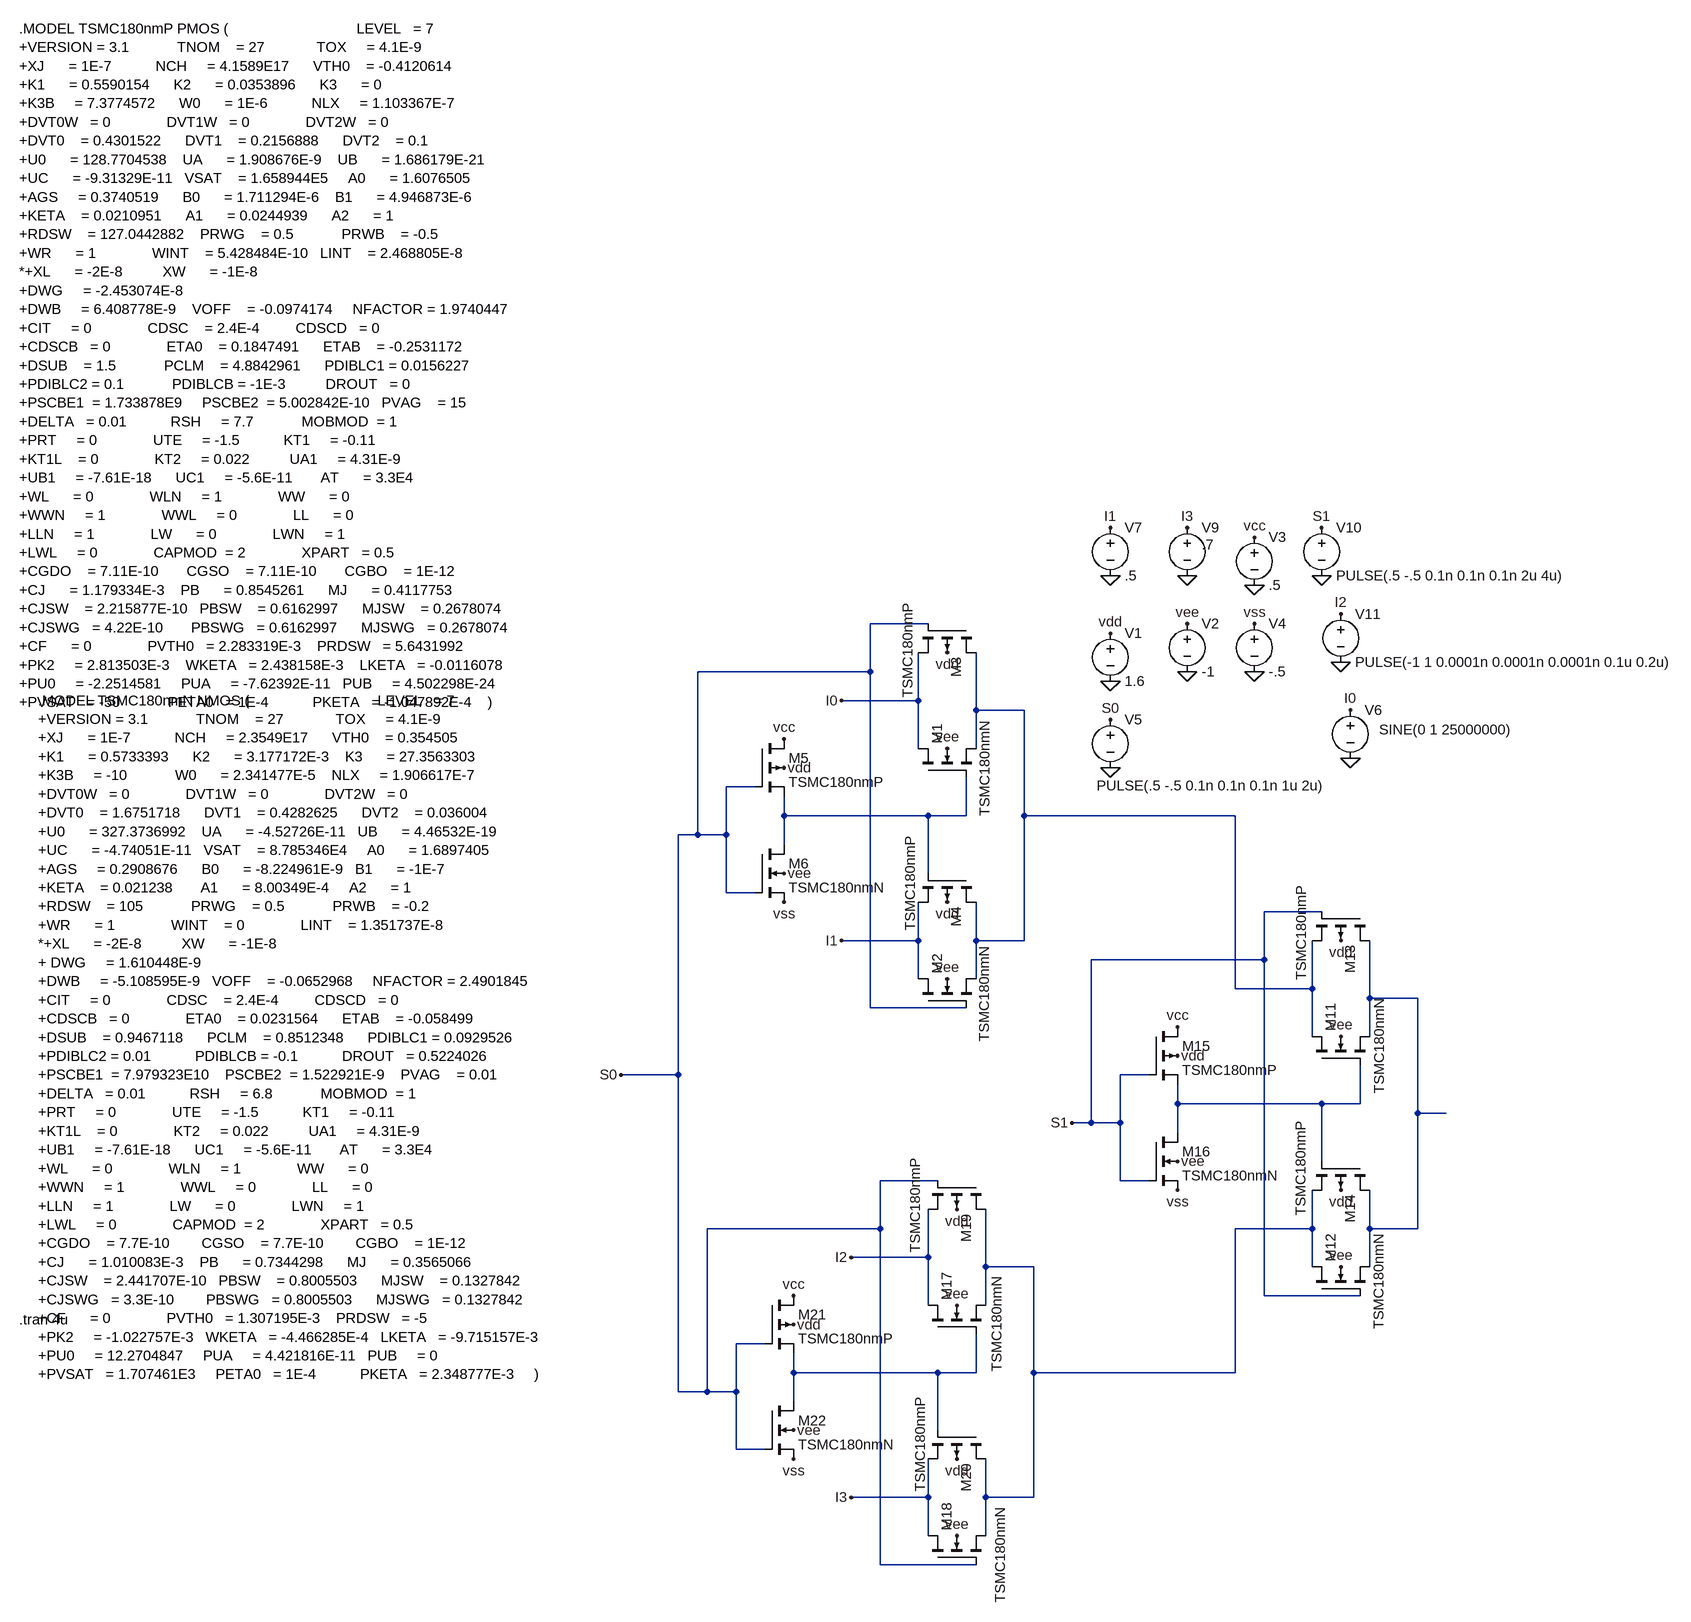
[diagram p0: schematic Data Acquisition System.asc]
Data Acquisition System.asc, the LTspice schematic file:
Version 4
SHEET 1 3424 1956
WIRE 1104 320 1008 320
WIRE 1008 400 1008 320
WIRE 1008 400 720 400
WIRE 1088 448 1088 368
WIRE 1088 448 960 448
WIRE 1184 464 1184 368
WIRE 1264 464 1184 464
WIRE 1088 528 1088 448
WIRE 1184 528 1184 464
WIRE 816 592 768 592
WIRE 864 640 864 608
WIRE 1104 640 864 640
WIRE 1168 640 1168 576
WIRE 1168 640 1104 640
WIRE 1264 640 1264 464
WIRE 1616 640 1264 640
WIRE 720 672 720 400
WIRE 720 672 688 672
WIRE 768 672 768 592
WIRE 768 672 720 672
WIRE 864 688 864 640
WIRE 1104 736 1104 640
WIRE 768 768 768 672
WIRE 816 768 768 768
WIRE 1760 800 1664 800
WIRE 1088 848 1088 784
WIRE 1088 848 960 848
WIRE 1184 848 1184 784
WIRE 1264 848 1264 640
WIRE 1264 848 1184 848
WIRE 1664 880 1664 800
WIRE 1664 880 1376 880
WIRE 1088 912 1088 848
WIRE 1184 912 1184 848
WIRE 1616 928 1616 640
WIRE 1744 928 1744 848
WIRE 1744 928 1616 928
WIRE 1840 944 1840 848
WIRE 1920 944 1840 944
WIRE 1008 960 1008 400
WIRE 1168 960 1008 960
WIRE 1744 1008 1744 928
WIRE 1840 1008 1840 944
WIRE 688 1072 688 672
WIRE 688 1072 592 1072
WIRE 1472 1072 1424 1072
WIRE 1520 1120 1520 1088
WIRE 1760 1120 1520 1120
WIRE 1824 1120 1824 1056
WIRE 1824 1120 1760 1120
WIRE 1920 1136 1920 944
WIRE 1968 1136 1920 1136
WIRE 1376 1152 1376 880
WIRE 1376 1152 1344 1152
WIRE 1424 1152 1424 1072
WIRE 1424 1152 1376 1152
WIRE 1520 1168 1520 1120
WIRE 1760 1216 1760 1120
WIRE 1120 1248 1024 1248
WIRE 1424 1248 1424 1152
WIRE 1472 1248 1424 1248
WIRE 1024 1328 1024 1248
WIRE 1024 1328 736 1328
WIRE 1744 1328 1744 1264
WIRE 1744 1328 1616 1328
WIRE 1840 1328 1840 1264
WIRE 1920 1328 1920 1136
WIRE 1920 1328 1840 1328
WIRE 1104 1376 1104 1296
WIRE 1104 1376 976 1376
WIRE 1200 1392 1200 1296
WIRE 1280 1392 1200 1392
WIRE 1744 1392 1744 1328
WIRE 1840 1392 1840 1328
WIRE 1664 1440 1664 880
WIRE 1824 1440 1664 1440
WIRE 1104 1456 1104 1376
WIRE 1200 1456 1200 1392
WIRE 832 1520 784 1520
WIRE 880 1568 880 1536
WIRE 1120 1568 880 1568
WIRE 1184 1568 1184 1504
WIRE 1184 1568 1120 1568
WIRE 1280 1568 1280 1392
WIRE 1616 1568 1616 1328
WIRE 1616 1568 1280 1568
WIRE 688 1600 688 1072
WIRE 736 1600 736 1328
WIRE 736 1600 688 1600
WIRE 784 1600 784 1520
WIRE 784 1600 736 1600
WIRE 880 1616 880 1568
WIRE 1120 1664 1120 1568
WIRE 784 1696 784 1600
WIRE 832 1696 784 1696
WIRE 1104 1776 1104 1712
WIRE 1104 1776 976 1776
WIRE 1200 1776 1200 1712
WIRE 1280 1776 1280 1568
WIRE 1280 1776 1200 1776
WIRE 1104 1840 1104 1776
WIRE 1200 1840 1200 1776
WIRE 1024 1888 1024 1328
WIRE 1184 1888 1024 1888
FLAG 1408 416 0
FLAG 1536 400 0
FLAG 1648 256 0
FLAG 1648 400 0
FLAG 1408 560 0
FLAG 1808 544 0
FLAG 1408 336 vdd
FLAG 1136 368 vdd
FLAG 1136 784 vdd
FLAG 1536 320 vee
FLAG 1136 528 vee
FLAG 1136 912 vee
FLAG 1648 176 vcc
FLAG 864 512 vcc
FLAG 1648 320 vss
FLAG 864 784 vss
FLAG 960 448 I0
FLAG 1808 464 I0
FLAG 960 848 I1
FLAG 1408 160 I1
FLAG 1408 240 0
FLAG 864 560 vdd
FLAG 864 736 vee
FLAG 1792 848 vdd
FLAG 1792 1264 vdd
FLAG 1792 1008 vee
FLAG 1792 1392 vee
FLAG 1520 992 vcc
FLAG 1520 1264 vss
FLAG 1520 1040 vdd
FLAG 1520 1216 vee
FLAG 1152 1296 vdd
FLAG 1152 1712 vdd
FLAG 1152 1456 vee
FLAG 1152 1840 vee
FLAG 880 1440 vcc
FLAG 880 1712 vss
FLAG 880 1488 vdd
FLAG 880 1664 vee
FLAG 592 1072 S0
FLAG 1408 480 S0
FLAG 1536 240 0
FLAG 976 1376 I2
FLAG 976 1776 I3
FLAG 1536 160 I3
FLAG 1760 240 0
FLAG 1344 1152 S1
FLAG 1760 160 S1
FLAG 1792 384 0
FLAG 1792 304 I2
SYMBOL nmos4 1088 576 R270
WINDOW 3 -65 111 Left 2
SYMATTR Value TSMC180nmN
SYMATTR InstName M1
SYMATTR Value2 l=0.18u w=0.36u
SYMBOL nmos4 1088 960 R270
WINDOW 3 -57 110 Left 2
SYMATTR Value TSMC180nmN
SYMATTR InstName M2
SYMATTR Value2 l=0.18u w=0.36u
SYMBOL pmos4 1184 320 R90
WINDOW 3 -34 113 Left 2
SYMATTR Value TSMC180nmP
SYMATTR InstName M3
SYMATTR Value2 l=0.18u w=0.9u
SYMBOL pmos4 1184 736 R90
WINDOW 3 -62 109 Left 2
SYMATTR Value TSMC180nmP
SYMATTR InstName M4
SYMATTR Value2 l=0.18u w=0.9u
SYMBOL pmos4 816 512 R0
SYMATTR InstName M5
SYMATTR Value TSMC180nmP
SYMATTR Value2 l=0.18u w=0.9u
SYMBOL nmos4 816 688 R0
SYMATTR InstName M6
SYMATTR Value TSMC180nmN
SYMATTR Value2 l=0.18u w=0.36u
SYMBOL voltage 1408 320 R0
WINDOW 123 0 0 Left 0
WINDOW 39 0 0 Left 0
SYMATTR InstName V1
SYMATTR Value 1.6
SYMBOL voltage 1536 304 R0
WINDOW 123 0 0 Left 0
WINDOW 39 0 0 Left 0
SYMATTR InstName V2
SYMATTR Value -1
SYMBOL voltage 1648 160 R0
WINDOW 123 0 0 Left 0
WINDOW 39 0 0 Left 0
SYMATTR InstName V3
SYMATTR Value .5
SYMBOL voltage 1648 304 R0
WINDOW 123 0 0 Left 0
WINDOW 39 0 0 Left 0
SYMATTR InstName V4
SYMATTR Value -.5
SYMBOL voltage 1408 464 R0
WINDOW 3 -23 126 Left 2
WINDOW 123 0 0 Left 0
WINDOW 39 0 0 Left 0
SYMATTR Value PULSE(.5 -.5 0.1n 0.1n 0.1n 1u 2u)
SYMATTR InstName V5
SYMBOL voltage 1808 448 R0
WINDOW 3 48 49 Left 2
WINDOW 123 0 0 Left 0
WINDOW 39 0 0 Left 0
SYMATTR Value SINE(0 1 25000000)
SYMATTR InstName V6
SYMBOL voltage 1408 144 R0
WINDOW 123 0 0 Left 0
WINDOW 39 0 0 Left 0
SYMATTR InstName V7
SYMATTR Value .5
SYMBOL nmos4 1744 1056 R270
WINDOW 3 -48 113 Left 2
SYMATTR Value TSMC180nmN
SYMATTR InstName M11
SYMATTR Value2 l=0.18u w=0.36u
SYMBOL nmos4 1744 1440 R270
WINDOW 3 -56 112 Left 2
SYMATTR Value TSMC180nmN
SYMATTR InstName M12
SYMATTR Value2 l=0.18u w=0.36u
SYMBOL pmos4 1840 800 R90
WINDOW 3 -43 113 Left 2
SYMATTR Value TSMC180nmP
SYMATTR InstName M13
SYMATTR Value2 l=0.18u w=0.9u
SYMBOL pmos4 1840 1216 R90
WINDOW 3 -67 114 Left 2
SYMATTR Value TSMC180nmP
SYMATTR InstName M14
SYMATTR Value2 l=0.18u w=0.9u
SYMBOL pmos4 1472 992 R0
SYMATTR InstName M15
SYMATTR Value TSMC180nmP
SYMATTR Value2 l=0.18u w=0.9u
SYMBOL nmos4 1472 1168 R0
SYMATTR InstName M16
SYMATTR Value TSMC180nmN
SYMATTR Value2 l=0.18u w=0.36u
SYMBOL nmos4 1104 1504 R270
WINDOW 3 -63 115 Left 2
SYMATTR Value TSMC180nmN
SYMATTR InstName M17
SYMATTR Value2 l=0.18u w=0.36u
SYMBOL nmos4 1104 1888 R270
WINDOW 3 -64 121 Left 2
SYMATTR Value TSMC180nmN
SYMATTR InstName M18
SYMATTR Value2 l=0.18u w=0.36u
SYMBOL pmos4 1200 1248 R90
WINDOW 3 -37 117 Left 2
SYMATTR Value TSMC180nmP
SYMATTR InstName M19
SYMATTR Value2 l=0.18u w=0.9u
SYMBOL pmos4 1200 1664 R90
WINDOW 3 -55 108 Left 2
SYMATTR Value TSMC180nmP
SYMATTR InstName M20
SYMATTR Value2 l=0.18u w=0.9u
SYMBOL pmos4 832 1440 R0
SYMATTR InstName M21
SYMATTR Value TSMC180nmP
SYMATTR Value2 l=0.18u w=0.9u
SYMBOL nmos4 832 1616 R0
SYMATTR InstName M22
SYMATTR Value TSMC180nmN
SYMATTR Value2 l=0.18u w=0.36u
SYMBOL voltage 1536 144 R0
WINDOW 3 24 44 Left 2
WINDOW 123 0 0 Left 0
WINDOW 39 0 0 Left 0
SYMATTR Value .7
SYMATTR InstName V9
SYMBOL voltage 1760 144 R0
WINDOW 123 0 0 Left 0
WINDOW 39 0 0 Left 0
SYMATTR InstName V10
SYMATTR Value PULSE(.5 -.5 0.1n 0.1n 0.1n 2u 4u)
SYMBOL voltage 1792 288 R0
WINDOW 123 0 0 Left 0
WINDOW 39 0 0 Left 0
SYMATTR InstName V11
SYMATTR Value PULSE(-1 1 0.0001n 0.0001n 0.0001n 0.1u 0.2u)
TEXT -1184 -672 Left 2 !.MODEL TSMC180nmP PMOS (                                LEVEL   = 7\n+VERSION = 3.1            TNOM    = 27             TOX     = 4.1E-9\n+XJ      = 1E-7           NCH     = 4.1589E17      VTH0    = -0.4120614\n+K1      = 0.5590154      K2      = 0.0353896      K3      = 0\n+K3B     = 7.3774572      W0      = 1E-6           NLX     = 1.103367E-7\n+DVT0W   = 0              DVT1W   = 0              DVT2W   = 0\n+DVT0    = 0.4301522      DVT1    = 0.2156888      DVT2    = 0.1\n+U0      = 128.7704538    UA      = 1.908676E-9    UB      = 1.686179E-21\n+UC      = -9.31329E-11   VSAT    = 1.658944E5     A0      = 1.6076505\n+AGS     = 0.3740519      B0      = 1.711294E-6    B1      = 4.946873E-6\n+KETA    = 0.0210951      A1      = 0.0244939      A2      = 1\n+RDSW    = 127.0442882    PRWG    = 0.5            PRWB    = -0.5\n+WR      = 1              WINT    = 5.428484E-10   LINT    = 2.468805E-8\n*+XL      = -2E-8          XW      = -1E-8          \n+DWG     = -2.453074E-8\n+DWB     = 6.408778E-9    VOFF    = -0.0974174     NFACTOR = 1.9740447\n+CIT     = 0              CDSC    = 2.4E-4         CDSCD   = 0\n+CDSCB   = 0              ETA0    = 0.1847491      ETAB    = -0.2531172\n+DSUB    = 1.5            PCLM    = 4.8842961      PDIBLC1 = 0.0156227\n+PDIBLC2 = 0.1            PDIBLCB = -1E-3          DROUT   = 0\n+PSCBE1  = 1.733878E9     PSCBE2  = 5.002842E-10   PVAG    = 15\n+DELTA   = 0.01           RSH     = 7.7            MOBMOD  = 1\n+PRT     = 0              UTE     = -1.5           KT1     = -0.11\n+KT1L    = 0              KT2     = 0.022          UA1     = 4.31E-9\n+UB1     = -7.61E-18      UC1     = -5.6E-11       AT      = 3.3E4\n+WL      = 0              WLN     = 1              WW      = 0\n+WWN     = 1              WWL     = 0              LL      = 0\n+LLN     = 1              LW      = 0              LWN     = 1\n+LWL     = 0              CAPMOD  = 2              XPART   = 0.5\n+CGDO    = 7.11E-10       CGSO    = 7.11E-10       CGBO    = 1E-12\n+CJ      = 1.179334E-3    PB      = 0.8545261      MJ      = 0.4117753\n+CJSW    = 2.215877E-10   PBSW    = 0.6162997      MJSW    = 0.2678074\n+CJSWG   = 4.22E-10       PBSWG   = 0.6162997      MJSWG   = 0.2678074\n+CF      = 0              PVTH0   = 2.283319E-3    PRDSW   = 5.6431992\n+PK2     = 2.813503E-3    WKETA   = 2.438158E-3    LKETA   = -0.0116078\n+PU0     = -2.2514581     PUA     = -7.62392E-11   PUB     = 4.502298E-24\n+PVSAT   = -50            PETA0   = 1E-4           PKETA   = -1.047892E-4    )
TEXT -1152 448 Left 2 !.MODEL TSMC180nmN NMOS (                                LEVEL   = 7\n+VERSION = 3.1            TNOM    = 27             TOX     = 4.1E-9\n+XJ      = 1E-7           NCH     = 2.3549E17      VTH0    = 0.354505\n+K1      = 0.5733393      K2      = 3.177172E-3    K3      = 27.3563303\n+K3B     = -10            W0      = 2.341477E-5    NLX     = 1.906617E-7\n+DVT0W   = 0              DVT1W   = 0              DVT2W   = 0\n+DVT0    = 1.6751718      DVT1    = 0.4282625      DVT2    = 0.036004\n+U0      = 327.3736992    UA      = -4.52726E-11   UB      = 4.46532E-19\n+UC      = -4.74051E-11   VSAT    = 8.785346E4     A0      = 1.6897405\n+AGS     = 0.2908676      B0      = -8.224961E-9   B1      = -1E-7\n+KETA    = 0.021238       A1      = 8.00349E-4     A2      = 1\n+RDSW    = 105            PRWG    = 0.5            PRWB    = -0.2\n+WR      = 1              WINT    = 0              LINT    = 1.351737E-8\n*+XL      = -2E-8          XW      = -1E-8         \n+ DWG     = 1.610448E-9\n+DWB     = -5.108595E-9   VOFF    = -0.0652968     NFACTOR = 2.4901845\n+CIT     = 0              CDSC    = 2.4E-4         CDSCD   = 0\n+CDSCB   = 0              ETA0    = 0.0231564      ETAB    = -0.058499\n+DSUB    = 0.9467118      PCLM    = 0.8512348      PDIBLC1 = 0.0929526\n+PDIBLC2 = 0.01           PDIBLCB = -0.1           DROUT   = 0.5224026\n+PSCBE1  = 7.979323E10    PSCBE2  = 1.522921E-9    PVAG    = 0.01\n+DELTA   = 0.01           RSH     = 6.8            MOBMOD  = 1\n+PRT     = 0              UTE     = -1.5           KT1     = -0.11\n+KT1L    = 0              KT2     = 0.022          UA1     = 4.31E-9\n+UB1     = -7.61E-18      UC1     = -5.6E-11       AT      = 3.3E4\n+WL      = 0              WLN     = 1              WW      = 0\n+WWN     = 1              WWL     = 0              LL      = 0\n+LLN     = 1              LW      = 0              LWN     = 1\n+LWL     = 0              CAPMOD  = 2              XPART   = 0.5\n+CGDO    = 7.7E-10        CGSO    = 7.7E-10        CGBO    = 1E-12\n+CJ      = 1.010083E-3    PB      = 0.7344298      MJ      = 0.3565066\n+CJSW    = 2.441707E-10   PBSW    = 0.8005503      MJSW    = 0.1327842\n+CJSWG   = 3.3E-10        PBSWG   = 0.8005503      MJSWG   = 0.1327842\n+CF      = 0              PVTH0   = 1.307195E-3    PRDSW   = -5\n+PK2     = -1.022757E-3   WKETA   = -4.466285E-4   LKETA   = -9.715157E-3\n+PU0     = 12.2704847     PUA     = 4.421816E-11   PUB     = 0\n+PVSAT   = 1.707461E3     PETA0   = 1E-4           PKETA   = 2.348777E-3     )
TEXT -1184 1480 Left 2 !.tran 4u

The netlist it stands for:
* Data Acquisition System.asc
M1 I0 N002 N001 vee TSMC180nmN l=0.18u w=0.36u
M2 I1 S0 N001 vee TSMC180nmN l=0.18u w=0.36u
M3 N001 S0 I0 vdd TSMC180nmP l=0.18u w=0.9u
M4 N001 N002 I1 vdd TSMC180nmP l=0.18u w=0.9u
M5 vcc S0 N002 vdd TSMC180nmP l=0.18u w=0.9u
M6 N002 S0 vss vee TSMC180nmN l=0.18u w=0.36u
V1 vdd 0 1.6
V2 vee 0 -1
V3 vcc 0 .5
V4 vss 0 -.5
V5 S0 0 PULSE(.5 -.5 0.1n 0.1n 0.1n 1u 2u)
V6 I0 0 SINE(0 1 25000000)
V7 I1 0 .5
M11 N001 N004 N003 vee TSMC180nmN l=0.18u w=0.36u
M12 N005 S1 N003 vee TSMC180nmN l=0.18u w=0.36u
M13 N003 S1 N001 vdd TSMC180nmP l=0.18u w=0.9u
M14 N003 N004 N005 vdd TSMC180nmP l=0.18u w=0.9u
M15 vcc S1 N004 vdd TSMC180nmP l=0.18u w=0.9u
M16 N004 S1 vss vee TSMC180nmN l=0.18u w=0.36u
M17 I2 N006 N005 vee TSMC180nmN l=0.18u w=0.36u
M18 I3 S0 N005 vee TSMC180nmN l=0.18u w=0.36u
M19 N005 S0 I2 vdd TSMC180nmP l=0.18u w=0.9u
M20 N005 N006 I3 vdd TSMC180nmP l=0.18u w=0.9u
M21 vcc S0 N006 vdd TSMC180nmP l=0.18u w=0.9u
M22 N006 S0 vss vee TSMC180nmN l=0.18u w=0.36u
V9 I3 0 .7
V10 S1 0 PULSE(.5 -.5 0.1n 0.1n 0.1n 2u 4u)
V11 I2 0 PULSE(-1 1 0.0001n 0.0001n 0.0001n 0.1u 0.2u)
.model NMOS NMOS
.model PMOS PMOS
.lib standard.mos
.MODEL TSMC180nmP PMOS (                                LEVEL   = 7
+VERSION = 3.1            TNOM    = 27             TOX     = 4.1E-9
+XJ      = 1E-7           NCH     = 4.1589E17      VTH0    = -0.4120614
+K1      = 0.5590154      K2      = 0.0353896      K3      = 0
+K3B     = 7.3774572      W0      = 1E-6           NLX     = 1.103367E-7
+DVT0W   = 0              DVT1W   = 0              DVT2W   = 0
+DVT0    = 0.4301522      DVT1    = 0.2156888      DVT2    = 0.1
+U0      = 128.7704538    UA      = 1.908676E-9    UB      = 1.686179E-21
+UC      = -9.31329E-11   VSAT    = 1.658944E5     A0      = 1.6076505
+AGS     = 0.3740519      B0      = 1.711294E-6    B1      = 4.946873E-6
+KETA    = 0.0210951      A1      = 0.0244939      A2      = 1
+RDSW    = 127.0442882    PRWG    = 0.5            PRWB    = -0.5
+WR      = 1              WINT    = 5.428484E-10   LINT    = 2.468805E-8
*+XL      = -2E-8          XW      = -1E-8
+DWG     = -2.453074E-8
+DWB     = 6.408778E-9    VOFF    = -0.0974174     NFACTOR = 1.9740447
+CIT     = 0              CDSC    = 2.4E-4         CDSCD   = 0
+CDSCB   = 0              ETA0    = 0.1847491      ETAB    = -0.2531172
+DSUB    = 1.5            PCLM    = 4.8842961      PDIBLC1 = 0.0156227
+PDIBLC2 = 0.1            PDIBLCB = -1E-3          DROUT   = 0
+PSCBE1  = 1.733878E9     PSCBE2  = 5.002842E-10   PVAG    = 15
+DELTA   = 0.01           RSH     = 7.7            MOBMOD  = 1
+PRT     = 0              UTE     = -1.5           KT1     = -0.11
+KT1L    = 0              KT2     = 0.022          UA1     = 4.31E-9
+UB1     = -7.61E-18      UC1     = -5.6E-11       AT      = 3.3E4
+WL      = 0              WLN     = 1              WW      = 0
+WWN     = 1              WWL     = 0              LL      = 0
+LLN     = 1              LW      = 0              LWN     = 1
+LWL     = 0              CAPMOD  = 2              XPART   = 0.5
+CGDO    = 7.11E-10       CGSO    = 7.11E-10       CGBO    = 1E-12
+CJ      = 1.179334E-3    PB      = 0.8545261      MJ      = 0.4117753
+CJSW    = 2.215877E-10   PBSW    = 0.6162997      MJSW    = 0.2678074
+CJSWG   = 4.22E-10       PBSWG   = 0.6162997      MJSWG   = 0.2678074
+CF      = 0              PVTH0   = 2.283319E-3    PRDSW   = 5.6431992
+PK2     = 2.813503E-3    WKETA   = 2.438158E-3    LKETA   = -0.0116078
+PU0     = -2.2514581     PUA     = -7.62392E-11   PUB     = 4.502298E-24
+PVSAT   = -50            PETA0   = 1E-4           PKETA   = -1.047892E-4    )
.MODEL TSMC180nmN NMOS (                                LEVEL   = 7
+VERSION = 3.1            TNOM    = 27             TOX     = 4.1E-9
+XJ      = 1E-7           NCH     = 2.3549E17      VTH0    = 0.354505
+K1      = 0.5733393      K2      = 3.177172E-3    K3      = 27.3563303
+K3B     = -10            W0      = 2.341477E-5    NLX     = 1.906617E-7
+DVT0W   = 0              DVT1W   = 0              DVT2W   = 0
+DVT0    = 1.6751718      DVT1    = 0.4282625      DVT2    = 0.036004
+U0      = 327.3736992    UA      = -4.52726E-11   UB      = 4.46532E-19
+UC      = -4.74051E-11   VSAT    = 8.785346E4     A0      = 1.6897405
+AGS     = 0.2908676      B0      = -8.224961E-9   B1      = -1E-7
+KETA    = 0.021238       A1      = 8.00349E-4     A2      = 1
+RDSW    = 105            PRWG    = 0.5            PRWB    = -0.2
+WR      = 1              WINT    = 0              LINT    = 1.351737E-8
*+XL      = -2E-8          XW      = -1E-8
+ DWG     = 1.610448E-9
+DWB     = -5.108595E-9   VOFF    = -0.0652968     NFACTOR = 2.4901845
+CIT     = 0              CDSC    = 2.4E-4         CDSCD   = 0
+CDSCB   = 0              ETA0    = 0.0231564      ETAB    = -0.058499
+DSUB    = 0.9467118      PCLM    = 0.8512348      PDIBLC1 = 0.0929526
+PDIBLC2 = 0.01           PDIBLCB = -0.1           DROUT   = 0.5224026
+PSCBE1  = 7.979323E10    PSCBE2  = 1.522921E-9    PVAG    = 0.01
+DELTA   = 0.01           RSH     = 6.8            MOBMOD  = 1
+PRT     = 0              UTE     = -1.5           KT1     = -0.11
+KT1L    = 0              KT2     = 0.022          UA1     = 4.31E-9
+UB1     = -7.61E-18      UC1     = -5.6E-11       AT      = 3.3E4
+WL      = 0              WLN     = 1              WW      = 0
+WWN     = 1              WWL     = 0              LL      = 0
+LLN     = 1              LW      = 0              LWN     = 1
+LWL     = 0              CAPMOD  = 2              XPART   = 0.5
+CGDO    = 7.7E-10        CGSO    = 7.7E-10        CGBO    = 1E-12
+CJ      = 1.010083E-3    PB      = 0.7344298      MJ      = 0.3565066
+CJSW    = 2.441707E-10   PBSW    = 0.8005503      MJSW    = 0.1327842
+CJSWG   = 3.3E-10        PBSWG   = 0.8005503      MJSWG   = 0.1327842
+CF      = 0              PVTH0   = 1.307195E-3    PRDSW   = -5
+PK2     = -1.022757E-3   WKETA   = -4.466285E-4   LKETA   = -9.715157E-3
+PU0     = 12.2704847     PUA     = 4.421816E-11   PUB     = 0
+PVSAT   = 1.707461E3     PETA0   = 1E-4           PKETA   = 2.348777E-3     )
.tran 4u
.backanno
.end